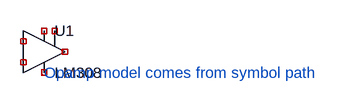
[diagram p0: schematic opamp-path.asc]
opamp-path.asc, the LTspice schematic file:
Version 4
SHEET 1 320 240
SYMBOL Opamps/LM308 0 0 R0
SYMATTR InstName U1
TEXT 0 96 Left 2 ;Opamp model comes from symbol path

The netlist it stands for:
* opamp-path.asc
XU1 NC_01 NC_02 NC_03 NC_04 NC_05 NC_06 NC_07 LT1008
* Opamp model comes from symbol path
.lib LTC.lib
.backanno
.end